# Altium project PCB_Project1.PrjPCB
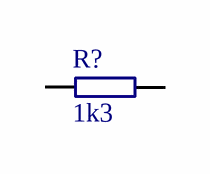
[diagram p0: Sheet1.SchDoc]
1 sheet, 1 parts. Net scope: global (net labels, ports and power ports of the same name join across sheets).

## Sheet Sheet1.SchDoc: =Name
size A3; Organization: Eindhoven; Address1: 5, High Tech Campus 9; Address2: 5656 AE Eindhoven; Address3: Netherlands; SheetNumber: 1; SheetTotal: 1; CompanyName: ProfiTap

### Parts
R?  value 1k3  [R0402]  (hidden comment: 1k3_50V_1%_62.5mW_0402)

### Nets

Not connected (* = marked no-connect by the designer): R? 1 2

### Notes on the sheet
- Project:
- Version:
- Size:
- A3
- Author:
- Date:
- Sheet:
- of
- File:

### Library data of the parts
R? = 1k3_50V_1%_62.5mW_0402: Resistor; Reviewed: IH; Power rating: 62.5mW; Voltage: 50V; Tolerance: 1%; P/N: *; Manufacturer: *; Populate: *